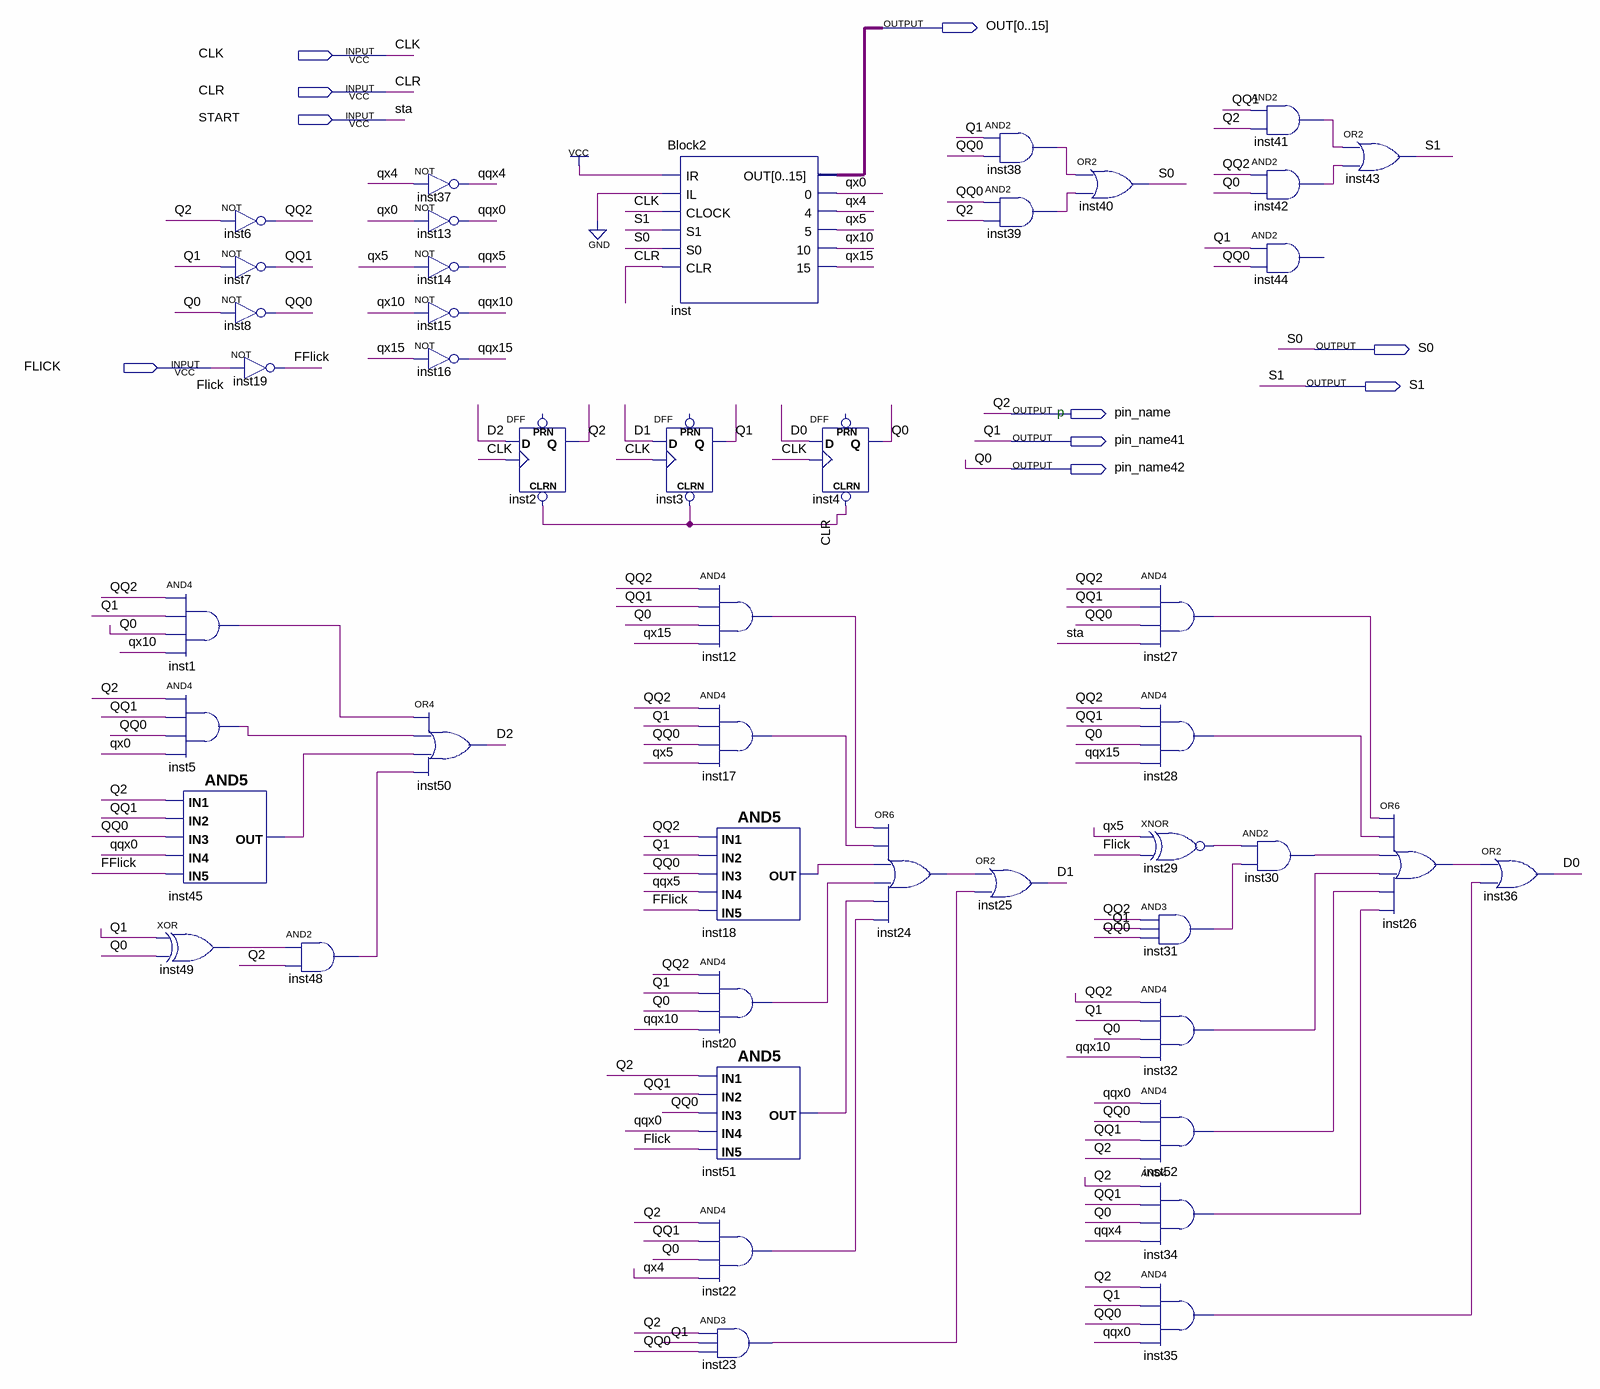
[diagram p0: schematic sheet]
// Quartus schematic FULL.bdf as structural Verilog: 46 symbols, 10 pins
module FULL (
  input  CLK,
  input  CLR,
  input  START,
  input  FLICK,
  output [0:15] OUT,
  output S0,
  output S1,
  output pin_name,
  output pin_name41,
  output pin_name42
);

  wire D0, D1, D2, FFlick, inst1_out, inst5_out, inst12_out, inst17_out, inst18_out, inst20_out, inst22_out,
       inst23_out, inst24_out, inst26_out, inst27_out, inst28_out, inst29_out, inst30_out, inst31_out,
       inst32_out, inst34_out, inst35_out, inst38_out, inst39_out, inst41_out, inst42_out, inst45_out,
       inst48_out, inst49_out, inst51_out, inst52_out, QQ0, QQ1, QQ2, qqx0, qqx4, qqx5, qqx10, qqx15, qx0,
       qx4, qx5, qx10, qx15;

  xor inst49 (inst49_out, pin_name41, pin_name42);
  not inst6 (QQ2, pin_name);
  not inst7 (QQ1, pin_name41);
  not inst8 (QQ0, pin_name42);
  not inst19 (FFlick, FLICK);
  and inst1 (inst1_out, QQ2, pin_name41, pin_name42, qx10);
  and inst5 (inst5_out, pin_name, QQ1, QQ0, qx0);
  and inst45 (inst45_out, pin_name, QQ1, QQ0, qqx0, FFlick);
  and inst48 (inst48_out, inst49_out, pin_name);
  not inst37 (qqx4, qx4);
  not inst13 (qqx0, qx0);
  not inst14 (qqx5, qx5);
  not inst15 (qqx10, qx10);
  not inst16 (qqx15, qx15);
  or inst50 (D2, inst1_out, inst5_out, inst45_out, inst48_out);
  DFF inst2 (.CLRN(CLR), .CLK(CLK), .D(D2), .Q(pin_name));  // open: PRN
  Block2 inst (
    .IR(1'b1), .IL(1'b0), .CLOCK(CLK), .S1(S1), .S0(S0), .CLR(CLR), .OUT(OUT), .\0 (qx0), .\4 (qx4),
    .\5 (qx5), .\10 (qx10), .\15 (qx15));
  DFF inst3 (.CLRN(CLR), .CLK(CLK), .D(D1), .Q(pin_name41));  // open: PRN
  and inst12 (inst12_out, QQ2, QQ1, pin_name42, qx15);
  and inst17 (inst17_out, QQ2, pin_name41, QQ0, qx5);
  and inst18 (inst18_out, QQ2, pin_name41, QQ0, qqx5, FFlick);
  and inst20 (inst20_out, QQ2, pin_name41, pin_name42, qqx10);
  and inst51 (inst51_out, pin_name, QQ1, QQ0, qqx0, FLICK);
  and inst22 (inst22_out, pin_name, QQ1, pin_name42, qx4);
  and inst23 (inst23_out, pin_name, pin_name41, QQ0);
  DFF inst4 (.CLRN(CLR), .CLK(CLK), .D(D0), .Q(pin_name42));  // open: PRN
  or inst24 (inst24_out, inst12_out, inst17_out, inst18_out, inst20_out, inst51_out, inst22_out);
  and inst38 (inst38_out, pin_name41, QQ0);
  and inst39 (inst39_out, QQ0, pin_name);
  or inst25 (D1, inst24_out, inst23_out);
  or inst40 (S0, inst38_out, inst39_out);
  and inst27 (inst27_out, QQ2, QQ1, QQ0, START);
  and inst28 (inst28_out, QQ2, QQ1, pin_name42, qqx15);
  xnor inst29 (inst29_out, qx5, FLICK);
  and inst31 (inst31_out, QQ2, pin_name41, QQ0);
  and inst32 (inst32_out, QQ2, pin_name41, pin_name42, qqx10);
  and inst52 (inst52_out, qqx0, QQ0, QQ1, pin_name);
  and inst34 (inst34_out, pin_name, QQ1, pin_name42, qqx4);
  and inst35 (inst35_out, pin_name, pin_name41, QQ0, qqx0);
  and inst41 (inst41_out, QQ1, pin_name);
  and inst42 (inst42_out, QQ2, pin_name42);
  // AND2 inst44 has open pins: IN1=pin_name41, IN2=QQ0, OUT=open
  and inst30 (inst30_out, inst29_out, inst31_out);
  or inst43 (S1, inst41_out, inst42_out);
  or inst26 (inst26_out, inst27_out, inst28_out, inst30_out, inst32_out, inst52_out, inst34_out);
  or inst36 (D0, inst26_out, inst35_out);

  // Other names for the same wires on the sheet: Q0 = pin_name42; Q1 = pin_name41; Q2 = pin_name; sta = START

  // Notes on the sheet:
  //   p
endmodule
